# Altium schematic sheet FLYBACK.SchDoc
size 420 x 297 mm; SheetNumber: 2; SheetTotal: 20
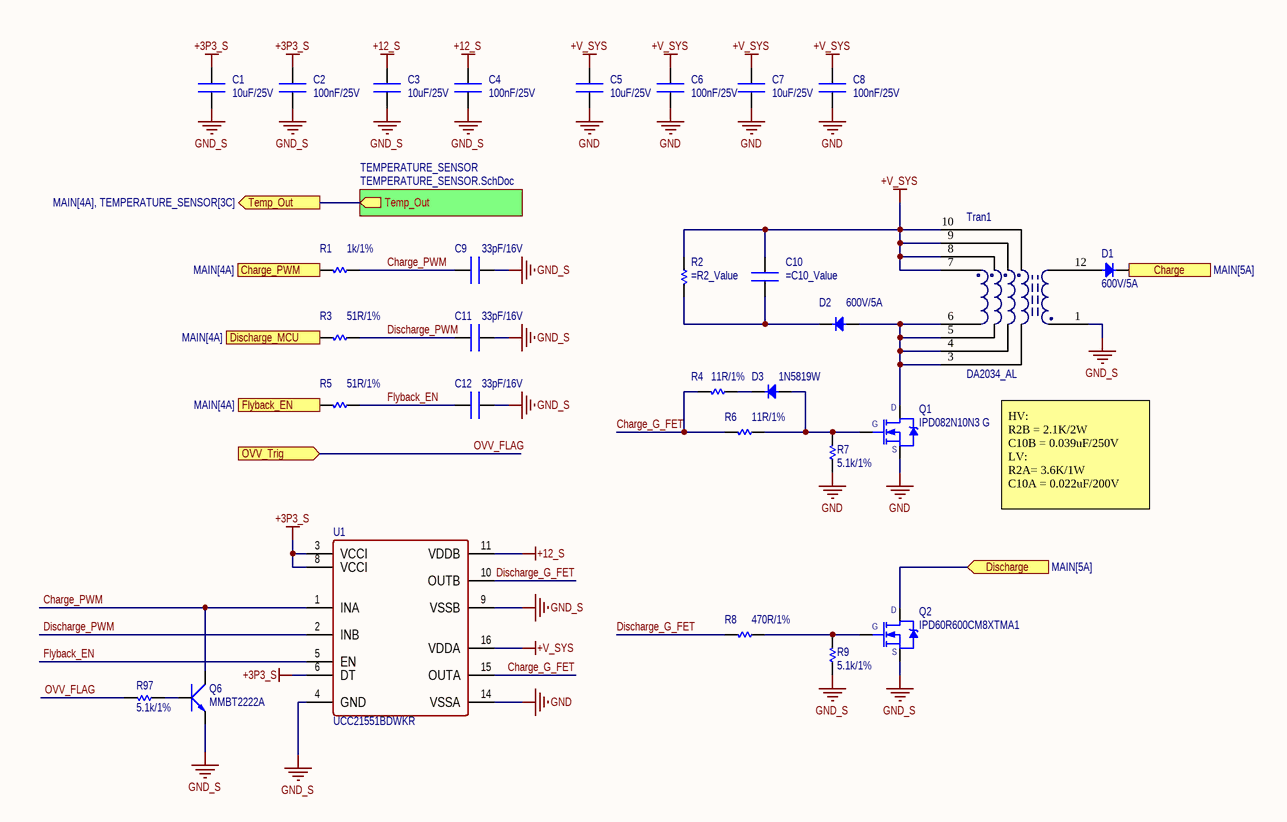
[diagram p0: FLYBACK.SchDoc]

## Parts
C1  10uF/25V  [CN-SMD-0603]
C2  100nF/25V  [CN-SMD-0603]
C3  10uF/25V  [CN-SMD-0603]
C4  100nF/25V  [CN-SMD-0603]
C5  10uF/25V  [CN-SMD-0603]
C6  100nF/25V  [CN-SMD-0603]
C7  10uF/25V  [CN-SMD-0603]
C8  100nF/25V  [CN-SMD-0603]
C9  33pF/16V  [CN-SMD-0603]
C10  (no value)  [CN-SMD-1206]
C11  33pF/16V  [CN-SMD-0603]
C12  33pF/16V  [CN-SMD-0603]
D1  600V/5A  [DIO-SMD-C]
D2  600V/5A  [DIO-SMD-C]
D3  1N5819W  [DIO-SMD-123]
Q1  IPD082N10N3 G  [TO252-123]
Q2  IPD60R600CM8XTMA1  [TO252-123]
Q6  MMBT2222A  [SOT23-132]
R1  1k/1%  [RES-SMD-0603]
R2  (no value)  [RES-SMD-1206]
R3  51R/1%  [RES-SMD-0603]
R4  11R/1%  [RES-SMD-1206]
R5  51R/1%  [RES-SMD-0603]
R6  11R/1%  [RES-SMD-1206]
R7  5.1k/1%  [RES-SMD-0603]
R8  470R/1%  [RES-SMD-0603]
R9  5.1k/1%  [RES-SMD-0603]
R97  5.1k/1%  [RES-SMD-0603]
Tran1  DA2034_AL  [DA2034_AL]
U1  UCC21551BDWKR  [UCC21551BDWKR]

## Sub-sheets
TEMPERATURE_SENSOR = TEMPERATURE_SENSOR.SchDoc: Temp_Out (out)

## Ports
Charge (out, see MAIN[5A]), Charge_PWM (in, see MAIN[4A]), Discharge (in, see MAIN[5A]), Discharge_MCU (in, see MAIN[4A]), Flyback_EN (in, see MAIN[4A]), OVV_Trig (in, see MAIN[4A]), Temp_Out (out, see MAIN[4A], TEMPERATURE_SENSOR[3C])

## Nets
+3P3_S: C1.2 C2.2 U1.3(VCCI) U1.6(DT) U1.8(VCCI)
+12_S: C3.2 C4.2 U1.11(VDDB)
+V_SYS: C5.2 C6.2 C7.2 C8.2 C10.2 R2.1 Tran1.7 Tran1.8 Tran1.9 Tran1.10 U1.16(VDDA)
GND: C5.1 C6.1 C7.1 C8.1 Q1.3(S) R7.1 U1.14(VSSA)
GND_S: C1.1 C2.1 C3.1 C4.1 C9.1 C11.1 C12.1 Q2.3(S) Q6.2(E) R9.1 Tran1.1 U1.4(GND) U1.9(VSSB)
Charge: D1.2(K) ; port Charge
Charge_G_FET: R4.2 R6.2 U1.15(OUTA)
Charge_PWM: C9.2 Q6.3(C) R1.1 U1.1(INA)
Charge_PWM: R1.2 ; port Charge_PWM  [a separate net that carries the same name]
Discharge: Q2.2(D) ; port Discharge
Discharge_G_FET: R8.2 U1.10(OUTB)
Discharge_MCU: R3.2 ; port Discharge_MCU
Discharge_PWM: C11.2 R3.1 U1.2(INB)
Flyback_EN: C12.2 R5.1 U1.5(EN)
Flyback_EN: R5.2 ; port Flyback_EN  [a separate net that carries the same name]
OVV_FLAG: R97.2 ; port OVV_Trig
Temp_Out: port Temp_Out, sheet TEMPERATURE_SENSOR/Temp_Out
NetC10_1: C10.1 D2.2(K) R2.2
NetD1_1: D1.1(A) Tran1.12
NetD2_1: D2.1(A) Q1.2(D) Tran1.3 Tran1.4 Tran1.5 Tran1.6
NetD3_1: D3.1(A) Q1.1(G) R6.1 R7.2
NetD3_2: D3.2(K) R4.1
NetQ2_1: Q2.1(G) R8.1 R9.2
NetQ6_1: Q6.1(B) R97.1

## Notes on the sheet
- (near Tran1) HV:
  R2B = 2.1K/2W
  C10B = 0.039uF/250V
  LV:
  R2A= 3.6K/1W
  C10A = 0.022uF/200V
- Project:
- Sub-system:
- Design by:
- Sheet title:
- Sheet
- of
- Checked by:
- Approved by:
- Document No:
- Revision:
- Size:
- Date:

## Library data of the parts
C1 C3 C5 C7 = CN: CAP CER 10UF 25V X5R 0603; PN: CL10A106MA8NRNC
C2 C4 C6 C8 = CN: CAP CER 0.1UF 25V X7R 0603; PN: CL10B104KA8NNNC
C9 C11 C12 = CN: CAP CER 33PF 16V X7R 0603; PN: C0603C330K4RACTU
C10 = CN: CAP CER 10000PF 630V X7R 1206; Value: CL31B103KHFNFNE; PN: CL31B103KHFNFNE
D1 D2 = Diode SMD: DIODE STANDARD 600V 5A DO214AB; Code - JEDEC: DO-214-AB; PN: VS-5ECU06-M3/9AT; Published: 8-Jun-2000; Revision: July-2002: Re-released for DXP Platform.; Publisher: Altium Limited
D3 = Diode SMD: DIODE SCHOTTKY 40V 1A SOD123FL; Code - JEDEC: DO-214-AB; Published: 8-Jun-2000; Revision: July-2002: Re-released for DXP Platform.; Publisher: Altium Limited; PN: 1N5819W
Q1 = FDD8870: MOSFET N-CH 100V 80A DPAK; PN: IPD082N10N3G
Q2 = FDD8870: MOSFET N-CH 600 V 7A (Tj) 64W (Tc) Surface Mount PG-TO252-3-313; PN: IPD60R600CM8XTMA1
Q6 = 2SC1815: TRANS NPN 40V 0.6A SOT-23; PN: MMBT2222A
R1 = Res-SMD: RES SMD 1K OHM 1% 1/10W 0603; Manufacturer: Generic Components; PN: ERJ-3EKF1001V; Class: Passive; Publisher: Altium Hobart Technology Centre
R2 = Res-SMD: RES SMD 8.2K OHM 0.5% 1W 1206; Manufacturer: Generic Components; PN: ERJ-P08F1502V; Class: Passive; Publisher: Altium Hobart Technology Centre; Parameter 1: *
R3 R5 = Res-SMD: RES SMD 51 OHM 1% 1/10W 0603; Manufacturer: Generic Components; PN: ERJ-3EKF51R0V; Class: Passive; Publisher: Altium Hobart Technology Centre
R4 R6 = Res-SMD: RES SMD 11 OHM 1% 3/4W 1206; Manufacturer: Generic Components; PN: CRCW120611R0FKEAHP; Class: Passive; Publisher: Altium Hobart Technology Centre
R7 R9 R97 = Res-SMD: RES SMD 5.1K OHM 1% 1/10W 0603; PN: ERJ-3EKF5101V
R8 = Res-SMD: RES 470 OHM 1% 1/10W 0603; Manufacturer: Generic Components; PN: RC0603FR-07470RL; Class: Passive; Publisher: Altium Hobart Technology Centre
Tran1 = DA2034_AL: Audio Transformers / Signal Transformers DA2032 Cap Chrgr For Linear LT3750/51; PN: DA2034_ALD
U1 = UCC21551BDWKR: 4A/6A 5KVRMS DUAL-CHANNEL ISOLAT; Manufacturer: Texas Instruments; PN: UCC21551BDWKR